# EAGLE schematic node6-gfe (EAGLE 6.5.0)
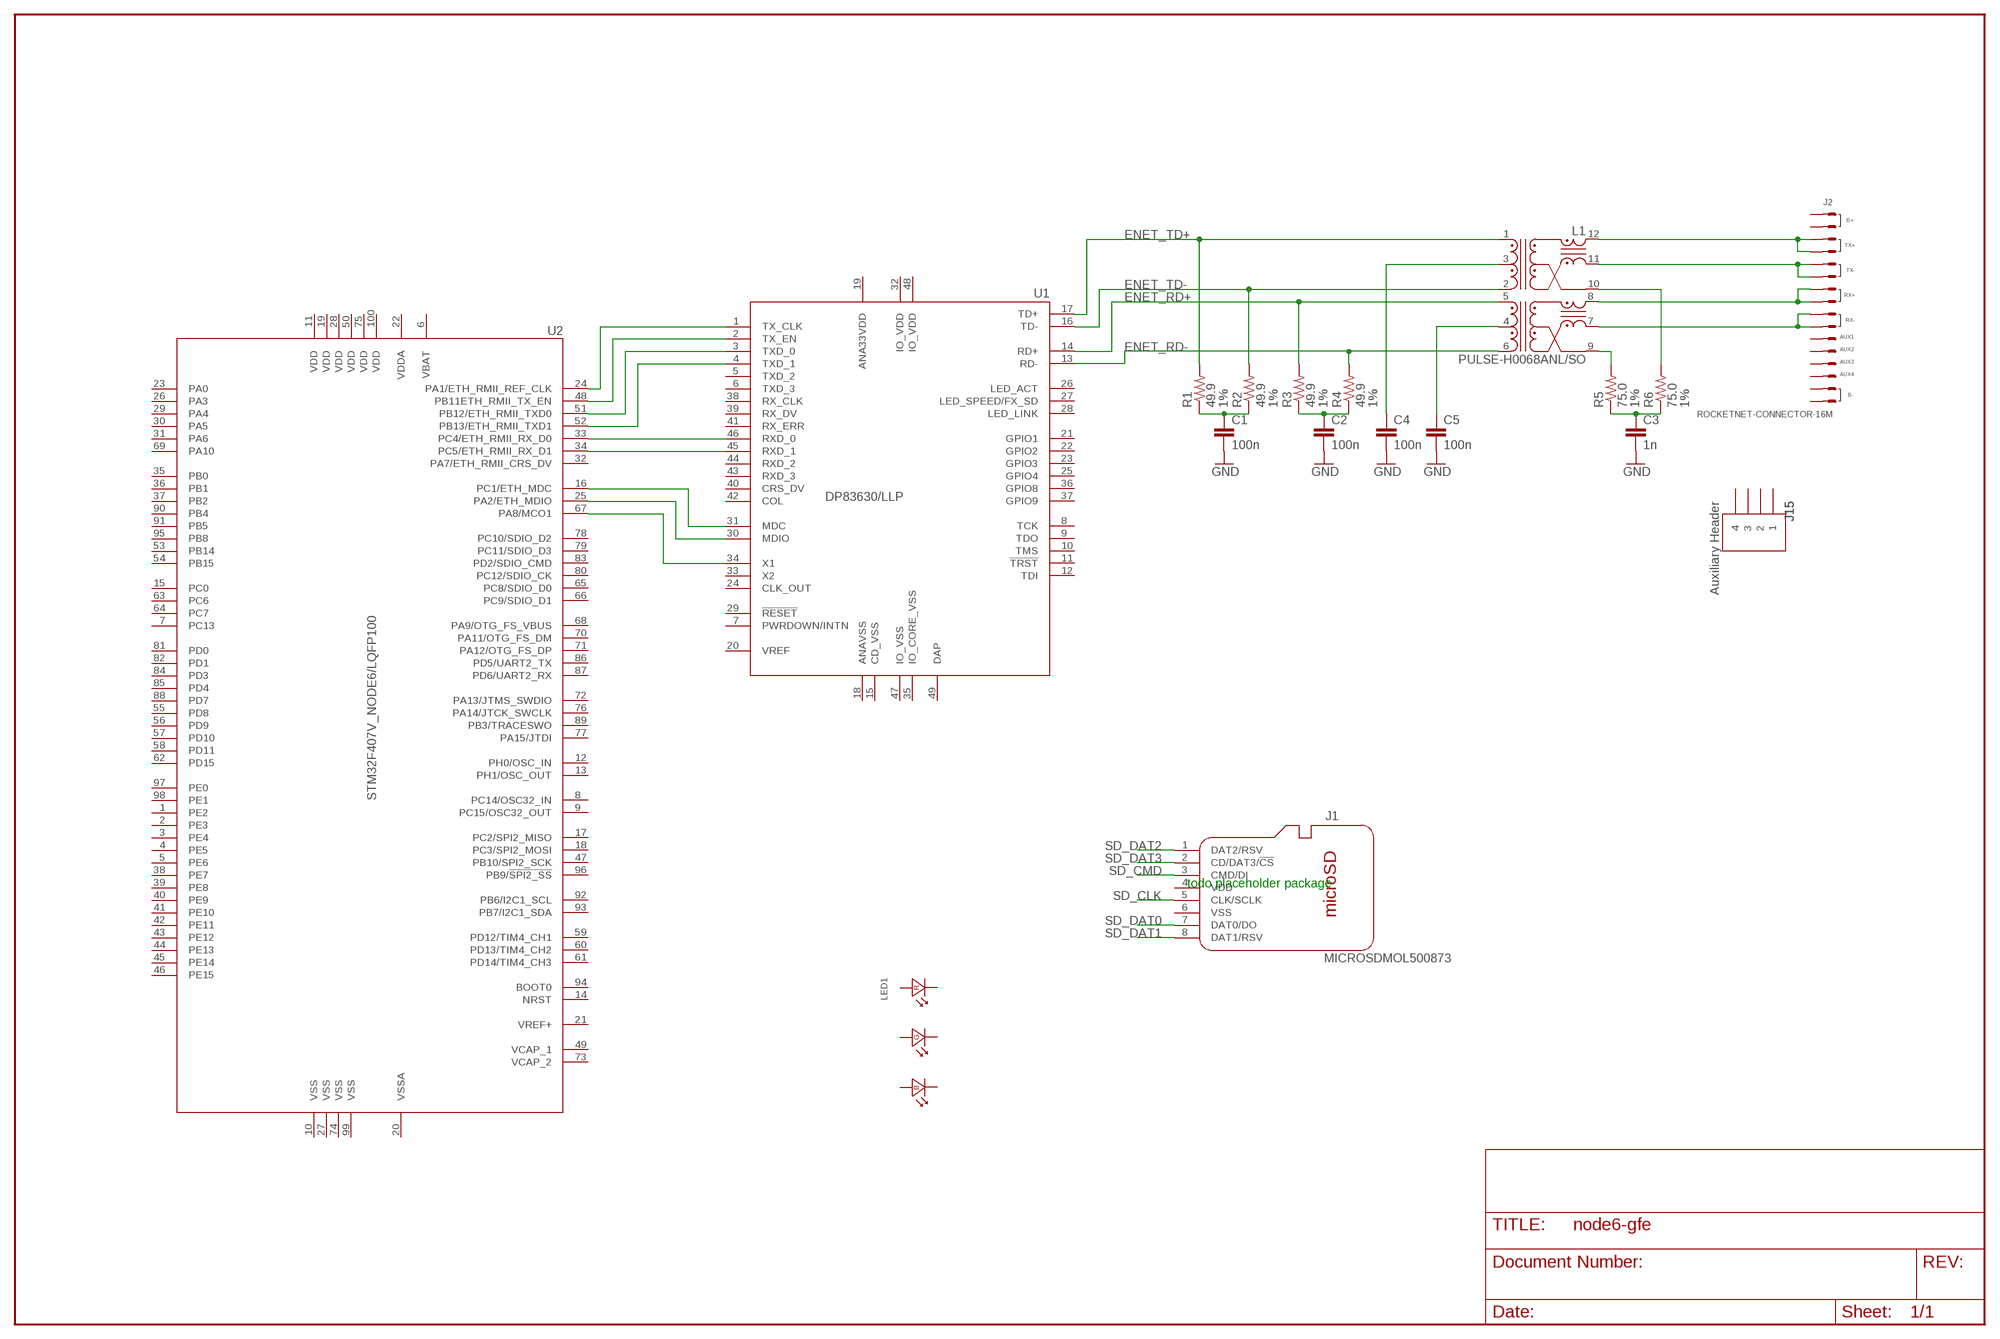
[diagram p0: schematic, sheet 1]

## Parts
C1  100n  C-EU0402-B-NOSILK  [0402-B-NOSILK]
C2  100n  C-EU0402-B-NOSILK  [0402-B-NOSILK]
C3  1n  C-EU0402-B-NOSILK  [0402-B-NOSILK]
C4  100n  C-EU0402-B-NOSILK  [0402-B-NOSILK]
C5  100n  C-EU0402-B-NOSILK  [0402-B-NOSILK]
J1  MICROSDMOL500873  [MOLEX-MICROSD-500873]
J2  ROCKETNET-CONNECTOR-16M  [ROCKETNET-M-16]
J15  Auxiliary Header  1.27MM_HDR_1X4  [INLINE]
L1  PULSE-H0068ANL/SO  [PULSE-H0068ANL]
LED1  LED_RGB_PLCC-6  [PLCC-6]
R1  49.9  R-US_0402-B-NOSILK  [0402-B-NOSILK]
R2  49.9  R-US_0402-B-NOSILK  [0402-B-NOSILK]
R3  49.9  R-US_0402-B-NOSILK  [0402-B-NOSILK]
R4  49.9  R-US_0402-B-NOSILK  [0402-B-NOSILK]
R5  75.0  R-US_0402-B-NOSILK  [0402-B-NOSILK]
R6  75.0  R-US_0402-B-NOSILK  [0402-B-NOSILK]
U1  DP83630/LLP  [QFN50P700X700X80-49N]
U2  STM32F407V_NODE6/LQFP100  [QFP50P1600X1600X160-100N]

## Nets
ENET_RD+: L1.5(TD+) R3.2 U1.14(RD+)
ENET_RD-: L1.6(TD-) R4.2 U1.13(RD-)
ENET_TD+: L1.1(RD+) R1.2 U1.17(TD+)
ENET_TD-: L1.2(RD-) R2.2 U1.16(TD-)
GND [PWR]: C1.2 C2.2 C3.2 C4.2 C5.2
N$1: J2.T-@9(TX-) J2.T-@11(TX-) L1.11(RX-)
N$2: J2.R+@5(RX+) J2.R+@7(RX+) L1.8(TX+)
N$3: U1.1(TX_CLK) U2.24(PA1/ETH_RMII_REF_CLK)
N$4: J2.R-@3(RX-) J2.R-@4(RX-) L1.7(TX-)
N$5: C1.1 R1.1 R2.1
N$6: J2.T+@13(TX+) J2.T+@14(TX+) L1.12(RX+)
N$7: L1.9(TXCT) R5.2
N$8: C2.1 R3.1 R4.1
N$9: L1.10(RXCT) R6.2
N$10: C3.1 R5.1 R6.1
N$11: C4.1 L1.3(RDCT)
N$12: C5.1 L1.4(TDCT)
N$13: U1.2(TX_EN) U2.48(PB11ETH_RMII_TX_EN)
N$14: U1.3(TXD_0) U2.51(PB12/ETH_RMII_TXD0)
N$15: U1.4(TXD_1) U2.52(PB13/ETH_RMII_TXD1)
N$16: U1.46(RXD_0) U2.33(PC4/ETH_RMII_RX_D0)
N$17: U1.45(RXD_1) U2.34(PC5/ETH_RMII_RX_D1)
N$18: U1.34(X1) U2.67(PA8/MCO1)
N$19: U1.30(MDIO) U2.25(PA2/ETH_MDIO)
N$20: U1.31(MDC) U2.16(PC1/ETH_MDC)
SD_CLK: J1.5(CLK/SCLK)
SD_CMD: J1.3(CMD/DI)
SD_DAT0: J1.7(DAT0/DO)
SD_DAT1: J1.8(DAT1/RSV)
SD_DAT2: J1.1(DAT2/RSV)
SD_DAT3: J1.2(CD/DAT3/!CS)
Unconnected: J1.T1(TAB) J1.T2(TAB) J1.T3(TAB) J1.T4(TAB) J2.A1(AUX1) J2.A2(AUX2) J2.A3(AUX3) J2.A4(AUX4) J15.1 J15.2 J15.3 J15.4 LED1.1(R:A) LED1.2(G:K) LED1.3(G:A) LED1.4(B:A) LED1.5(B:K) LED1.6(R:K) U1.5(TXD_2) U1.6(TXD_3) U1.7(PWRDOWN/INTN) U1.8(TCK) U1.9(TDO) U1.10(TMS) U1.11(!TRST) U1.12(TDI) U1.20(VREF) U1.21(GPIO1) U1.22(GPIO2) U1.23(GPIO3) U1.24(CLK_OUT) U1.25(GPIO4) U1.26(LED_ACT) U1.27(LED_SPEED/FX_SD) U1.28(LED_LINK) U1.29(!RESET) U1.33(X2) U1.36(GPIO8) U1.37(GPIO9) U1.38(RX_CLK) U1.39(RX_DV) U1.40(CRS_DV) U1.41(RX_ERR) U1.42(COL) U1.43(RXD_3) U1.44(RXD_2) U1.49(DAP) U2.1(PE2) U2.2(PE3) U2.3(PE4) U2.4(PE5) U2.5(PE6) U2.6(VBAT) U2.7(PC13) U2.8(PC14/OSC32_IN) U2.9(PC15/OSC32_OUT) U2.10(VSS) U2.11(VDD) U2.12(PH0/OSC_IN) U2.13(PH1/OSC_OUT) U2.14(NRST) U2.15(PC0) U2.17(PC2/SPI2_MISO) U2.18(PC3/SPI2_MOSI) U2.19(VDD) U2.20(VSSA) U2.21(VREF+) U2.22(VDDA) U2.23(PA0) U2.26(PA3) U2.27(VSS) U2.28(VDD) U2.29(PA4) U2.30(PA5) U2.31(PA6) U2.32(PA7/ETH_RMII_CRS_DV) U2.35(PB0) U2.36(PB1) U2.37(PB2) U2.38(PE7) U2.39(PE8) U2.40(PE9) U2.41(PE10) U2.42(PE11) U2.43(PE12) U2.44(PE13) U2.45(PE14) U2.46(PE15) U2.47(PB10/SPI2_SCK) U2.49(VCAP_1) U2.50(VDD) U2.53(PB14) U2.54(PB15) U2.55(PD8) U2.56(PD9) U2.57(PD10) U2.58(PD11) U2.59(PD12/TIM4_CH1) U2.60(PD13/TIM4_CH2) U2.61(PD14/TIM4_CH3) U2.62(PD15) U2.63(PC6) U2.64(PC7) U2.65(PC8/SDIO_D0) U2.66(PC9/SDIO_D1) U2.68(PA9/OTG_FS_VBUS) U2.69(PA10) U2.70(PA11/OTG_FS_DM) U2.71(PA12/OTG_FS_DP) U2.72(PA13/JTMS_SWDIO) U2.73(VCAP_2) U2.74(VSS) U2.75(VDD) U2.76(PA14/JTCK_SWCLK) U2.77(PA15/JTDI) U2.78(PC10/SDIO_D2) U2.79(PC11/SDIO_D3) U2.80(PC12/SDIO_CK) U2.81(PD0) U2.82(PD1) U2.83(PD2/SDIO_CMD) U2.84(PD3) U2.85(PD4) U2.86(PD5/UART2_TX) U2.87(PD6/UART2_RX) U2.88(PD7) U2.89(PB3/TRACESWO) U2.90(PB4) U2.91(PB5) U2.92(PB6/I2C1_SCL) U2.93(PB7/I2C1_SDA) U2.94(BOOT0) U2.95(PB8) U2.96(PB9/!SPI2_SS) U2.97(PE0) U2.98(PE1) U2.99(VSS) U2.100(VDD)

## Notes on the sheet
- todo placeholder package

## Power pins joined to a net without a drawn wire
ANA33VDD: U1.19(ANA33VDD)
ANAVSS: U1.18(ANAVSS)
B+: J2.B+@15(B+) J2.B+@16(B+)
B-: J2.B-@1(B-) J2.B-@2(B-)
CD_VSS: U1.15(CD_VSS)
IO_CORE_VSS: U1.35(IO_CORE_VSS)
IO_VDD: U1.32(IO_VDD) U1.48(IO_VDD)
IO_VSS: U1.47(IO_VSS)
VDD: J1.4(VDD)
VSS: J1.6(VSS)

## Library data of the parts
C1-C5 = rcl_custom:C-EU: CAPACITOR, European symbol
J1 = connector:MICROSD
J2 = rocketnet-connector:ROCKETNET-CONNECTOR-16
J15 = headers:1.27MM_HDR_1X4
L1 = magnetics:PULSE-H0068ANL
LED1 = LED_RGB_PLCC6:LED_RGB_*: RGB LED with separate contacts for all 3 chips
R1-R6 = rcl_custom:R-US_: RESISTOR, American symbol; TOLERANCE: 1%
U1 = DP83630:DP83630
U2 = stm32:STM32F407V_NODE6

## Net classes
0 default: width 0.127 mm, drill 0.203 mm, clearance 0.127 mm
1 PWR: width 0.127 mm, drill 0.203 mm, clearance 0.127 mm to class 0, clearance 0.127 mm